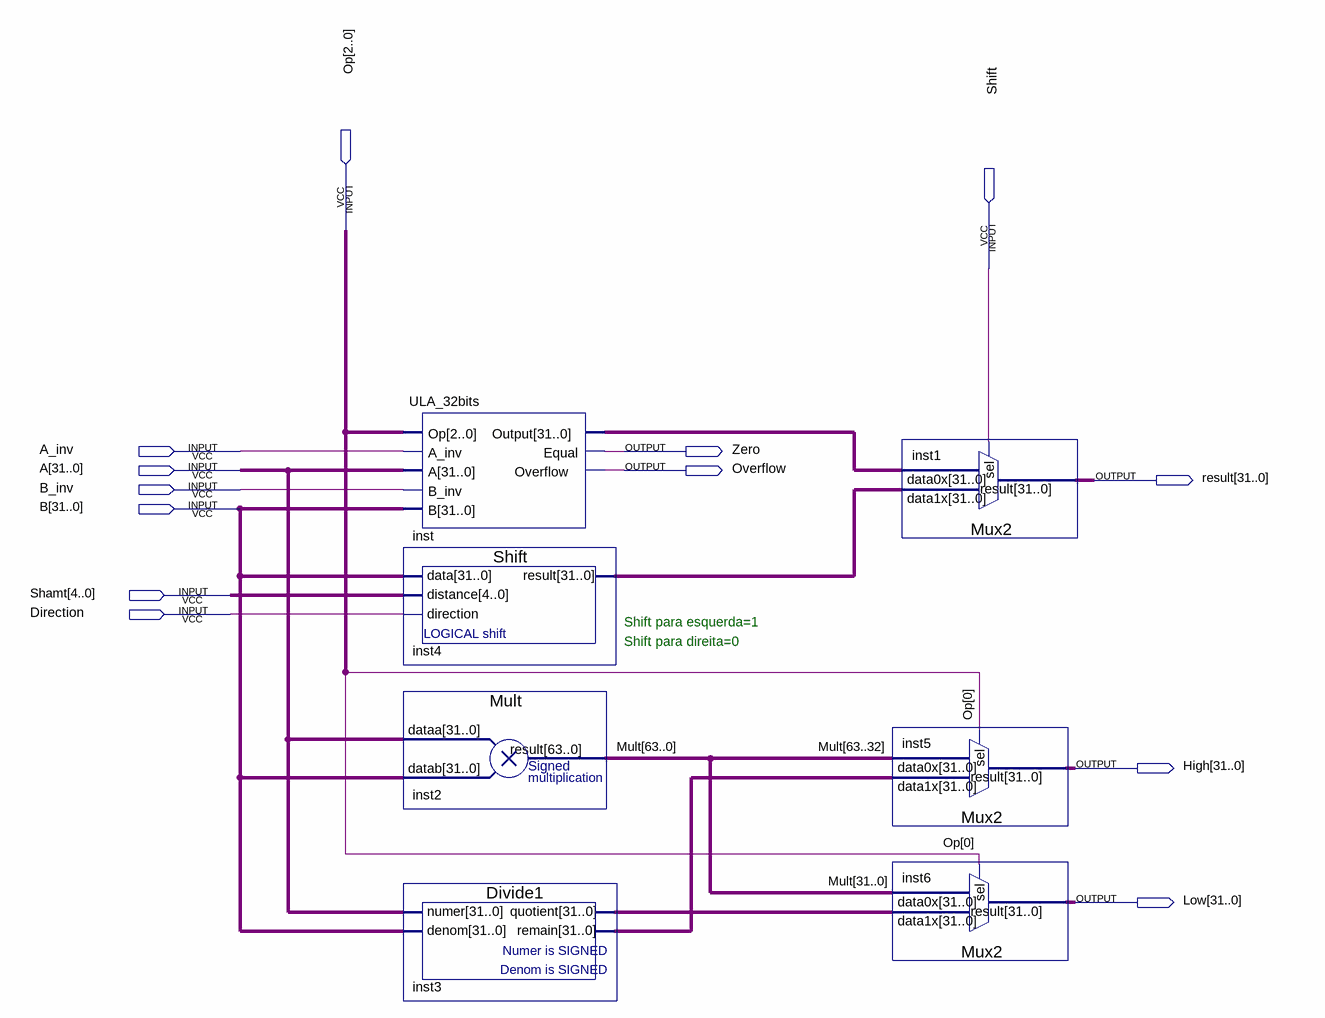
[diagram p0: schematic sheet]
// Quartus schematic ULA_Full.bdf as structural Verilog: 7 symbols, 13 pins
module ULA_Full (
  input  [2:0] Op,
  input  Shift,
  input  A_inv,
  input  [31:0] A,
  input  B_inv,
  input  [31:0] B,
  input  [4:0] Shamt,
  input  Direction,
  output Zero,
  output Overflow,
  output [31:0] result,
  output [31:0] High,
  output [31:0] Low
);

  wire [31:0] inst3_quotient, inst3_remain, inst4_result, inst_output;
  wire [63:0] Mult;

  ULA_32bits inst (
    .Op(Op), .A_inv(A_inv), .A(A), .B_inv(B_inv), .B(B), .Output(inst_output), .Equal(Zero),
    .Overflow(Overflow));
  Shift inst4 (.data(B), .distance(Shamt), .direction(Direction), .result(inst4_result));
  Mult inst2 (.dataa(A), .datab(B), .result(Mult));
  Divide1 inst3 (.numer(A), .denom(B), .quotient(inst3_quotient), .remain(inst3_remain));
  Mux2 inst1 (.data1x(inst4_result), .data0x(inst_output), .sel(Shift), .result(result));
  Mux2 inst5 (.data1x(inst3_remain), .data0x(Mult[63:32]), .sel(Op[0]), .result(High));
  Mux2 inst6 (.data1x(inst3_quotient), .data0x(Mult[31:0]), .sel(Op[0]), .result(Low));

  // Notes on the sheet:
  //   Shift para esquerda=1
  //   Shift para direita=0
endmodule
